# Altium schematic sheet Sheet1.SchDoc: Микромодуль беспроводной связи ВЧ
size 420 x 297 mm; ApprovedBy: Алексеев; CheckedBy: Богданов; Author: Пятиренко; DocumentNumber: АЕСН.464431.003Э3; SheetTotal: 1; PERVICH PRIM: АЕСН.464431.003; Title2: Схема электрическая принципиальная; DocumentName: Sheet1.SCHDOC; Application_BuildNumber: sdfsdfsdfsdfsdfs
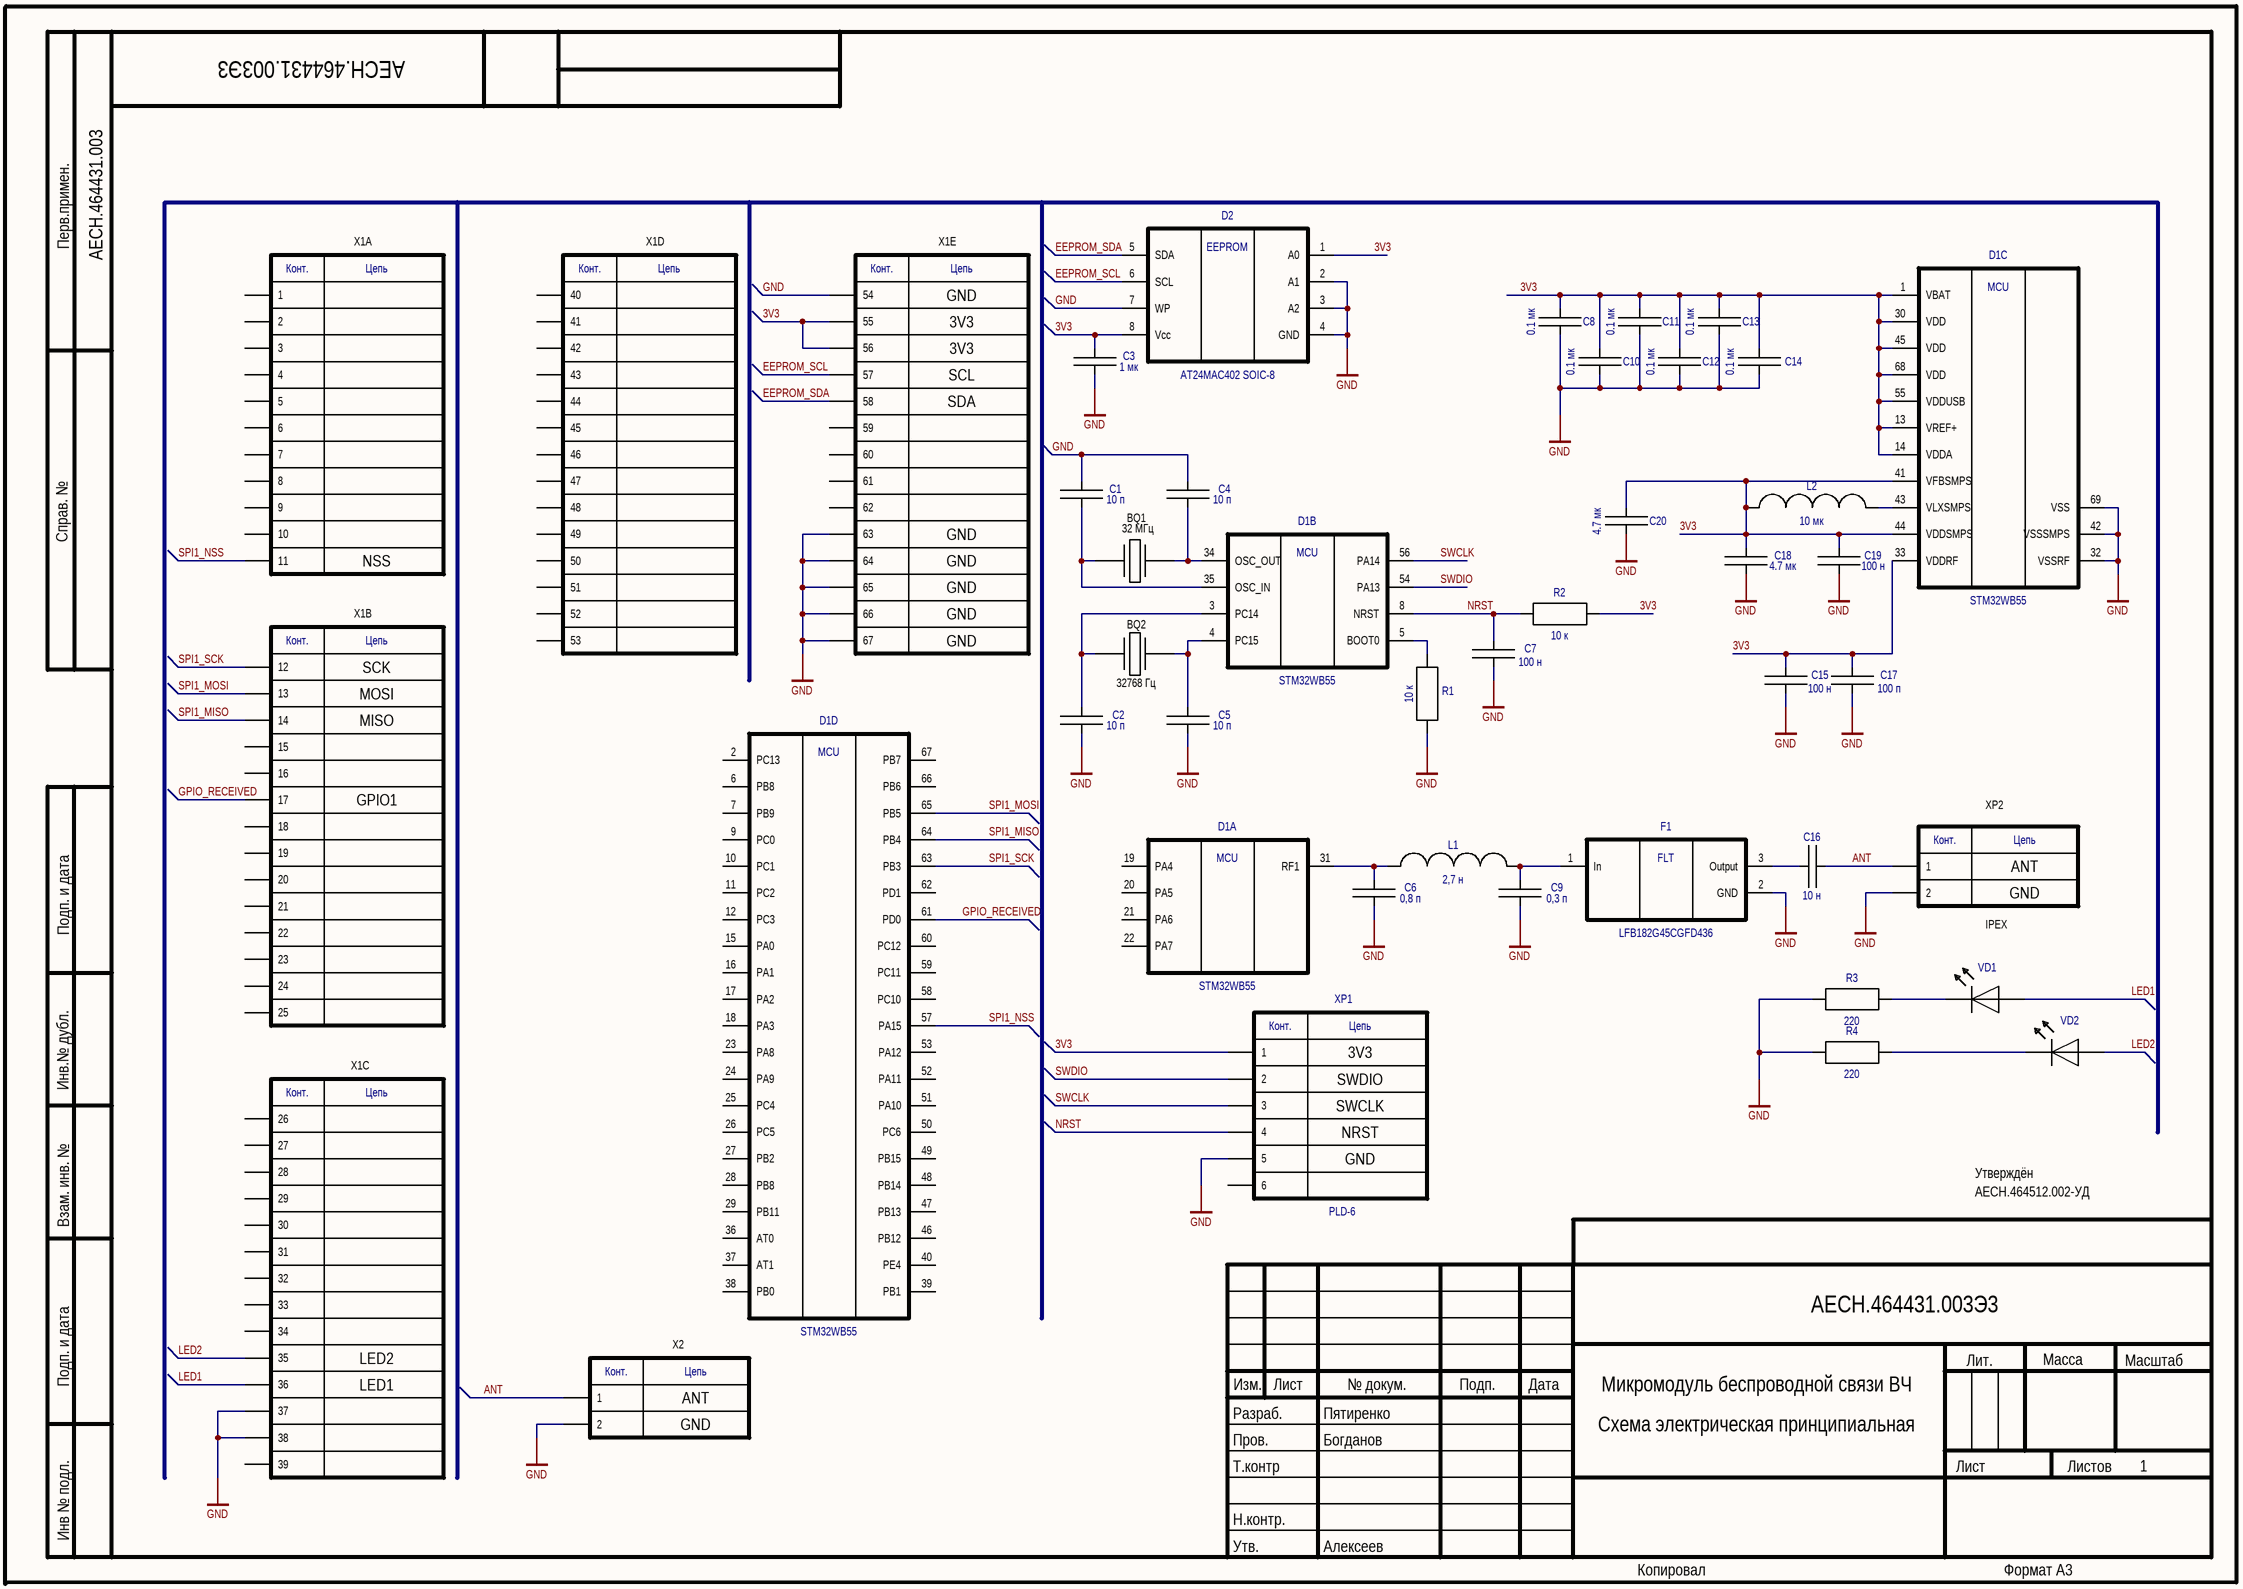
[diagram p0: Sheet1.SchDoc]

## Parts
BQ1  value 32 МГц  [Crystal_2520]  (hidden comment: Quarz)
BQ2  value 32768 Гц  [ABS07]  (hidden comment: Quarz)
C1  value 10 п  [C0603]  (hidden comment: C)
C2  value 10 п  [C0603]  (hidden comment: C)
C3  value 1 мк  [C0603]  (hidden comment: C)
C4  value 10 п  [C0603]  (hidden comment: C)
C5  value 10 п  [C0603]  (hidden comment: C)
C6  value 0,8 п  [C0603]  (hidden comment: C)
C7  value 100 н  [C0603]  (hidden comment: C)
C8  value 0.1 мк  [C0603]  (hidden comment: C)
C9  value 0,3 п  [C0603]  (hidden comment: C)
C10  value 0.1 мк  [C0603]  (hidden comment: C)
C11  value 0.1 мк  [C0603]  (hidden comment: C)
C12  value 0.1 мк  [C0603]  (hidden comment: C)
C13  value 0.1 мк  [C0603]  (hidden comment: C)
C14  value 0.1 мк  [C0603]  (hidden comment: C)
C15  value 100 н  [C0603]  (hidden comment: C)
C16  value 10 н  [C0603]  (hidden comment: C)
C17  value 100 п  [C0603]  (hidden comment: C)
C18  value 4.7 мк  [C0603]  (hidden comment: C)
C19  value 100 н  [C0603]  (hidden comment: C)
C20  value 4.7 мк  [C0603]  (hidden comment: C)
D1  STM32WB55  [VFQFN68-8x8mm]  (parts A,B,C,D of 4)
D2  AT24MAC402 SOIC-8  [SOIC8]
F1  LFB182G45CGFD436  [0603_3pin]
L1  value 2,7 н  [INDC_0603]  (hidden comment: L)
L2  value 10 мк  [R0805]  (hidden comment: L)
R1  value 10 к  [R0603]  (hidden comment: R)
R2  value 10 к  [R0603]  (hidden comment: R)
R3  value 220  [R0603]  (hidden comment: R)
R4  value 220  [R0603]  (hidden comment: R)
VD1  LED  [LED_0805]  (value not drawn)
VD2  LED  [LED_0805]  (value not drawn)
X1  M.2 - 1-2199230-4  [M.2 - 1-2199230-4 EDGE]  (value not drawn)  (parts A,B,C,D,E of 5)
X2  (no value)  [SMA_kont]
XP1  PLD-6  [PLD-6]
XP2  IPEX  [IPEX]

## Nets
GND: C1.1 C2.2 C3.2 C4.1 C5.2 C6.2 C7.2 C8.2 C9.2 C10.2 C11.2 C12.2 C13.2 C14.2 C15.2 C17.2 C18.2 C19.2 C20.2 D1.32(VSSRF) D1.42(VSSSMPS) D1.69(VSS) D2.2(A1) D2.3(A2) D2.4(GND) D2.7(WP) F1.2(GND) R1.1 R3.2 R4.2 X1.37 X1.38 X1.54 X1.63 X1.64 X1.65 X1.66 X1.67 X2.2 XP1.5 XP2.2
3V3: C3.1 C8.1 C10.1 C11.1 C12.1 C13.1 C14.1 C15.1 C17.1 C18.1 C19.1 C20.1 D1.1(VBAT) D1.13(VREF+) D1.14(VDDA) D1.30(VDD) D1.33(VDDRF) D1.41(VFBSMPS) D1.44(VDDSMPS) D1.45(VDD) D1.55(VDDUSB) D1.68(VDD) D2.1(A0) D2.8(Vcc) L2.1 R2.1 X1.55 X1.56 XP1.1
ANT: C16.2 X2.1 XP2.1
EEPROM_SCL: D2.6(SCL) X1.57
EEPROM_SDA: D2.5(SDA) X1.58
GPIO_RECEIVED: D1.61(PD0) X1.17
LED1: VD1.1 X1.36
LED2: VD2.1 X1.35
NRST: C7.1 D1.8(NRST) R2.2 XP1.4
SPI1_MISO: D1.64(PB4) X1.14
SPI1_MOSI: D1.65(PB5) X1.13
SPI1_NSS: D1.57(PA15) X1.11
SPI1_SCK: D1.63(PB3) X1.12
SWCLK: D1.56(PA14) XP1.3
SWDIO: D1.54(PA13) XP1.2
NetBQ1_1: BQ1.1 C1.2 D1.35(OSC_IN)
NetBQ1_2: BQ1.2 C4.2 D1.34(OSC_OUT)
NetBQ2_1: BQ2.1 C2.1 D1.3(PC14)
NetBQ2_2: BQ2.2 C5.1 D1.4(PC15)
NetC6_1: C6.1 D1.31(RF1) L1.1
NetC9_1: C9.1 F1.1(In) L1.2
NetC16_1: C16.1 F1.3(Output)
NetD1_5: D1.5(BOOT0) R1.2
NetD1_43: D1.43(VLXSMPS) L2.2
NetR3_1: R3.1 VD1.2
NetR4_1: R4.1 VD2.2

Not connected (* = marked no-connect by the designer): D1 2(PC13) 6(PB8) 7(PB9) 9(PC0) 10(PC1) 11(PC2) 12(PC3) 15(PA0) 16(PA1) 17(PA2) 18(PA3) 19(PA4) 20(PA5) 21(PA6) 22(PA7) 23(PA8) 24(PA9) 25(PC4) 26(PC5) 27(PB2) 28(PB8) 29(PB11) 36(AT0) 37(AT1) 38(PB0) 39(PB1) 40(PE4) 46(PB12) 47(PB13) 48(PB14) 49(PB15) 50(PC6) 51(PA10) 52(PA11) 53(PA12) 58(PC10) 59(PC11) 60(PC12) 62(PD1) 66(PB6) 67(PB7); X1 1 2 3 4 5 6 7 8 9 10 15 16 18 19 20 21 22 23 24 25 26 27 28 29 30 31 32 33 34 39 40 41 42 43 44 45 46 47 48 49 50 51 52 53 59 60 61 62; XP1 6

## Notes on the sheet
- 3V3
- GND
- SDA
- SCL
- NSS
- SCK
- MISO
- MOSI
- GPIO1
- ANT
- SWDIO
- SWCLK
- NRST
- АЕСН.464512.002-УД
- Утверждён
- LED1
- LED2
- Перв.примен.
- Справ. №
- Подп. и дата
- Инв.№ дубл.
- Взам. инв. №
- Изм.
- Лист
- № докум.
- Подп.
- Дата
- Лит.
- Масса
- Масштаб
- Пров.
- Т.контр
- Разраб.
- Листов
- Инв № подл.
- Н.контр.
- Утв.
- Копировал
- Формат А3
- (in symbol 2pin) Конт.; Цепь
- (in symbol 6pin) Конт.; Цепь
- (in symbol AT24MAC402) EEPROM
- (in symbol LFB182G45CGFD436) FLT
- (in symbol M.2, part A) Конт.; Цепь
- (in symbol M.2, part B) Конт.; Цепь
- (in symbol M.2, part C) Конт.; Цепь
- (in symbol M.2, part D) Конт.; Цепь
- (in symbol M.2, part E) Конт.; Цепь
- (in symbol STM32WB55, part A) MCU
- (in symbol STM32WB55, part B) MCU
- (in symbol STM32WB55, part C) MCU
- (in symbol STM32WB55, part D) MCU

## Library data of the parts
D2 = AT24MAC402
VD1 VD2 = VD_LED: Voltage: ?
X1 = M.2
X2 XP2 = 2pin
XP1 = 6pin: Manufacturer: *; PartNumber: PLD-6
C1-C20 = C: Voltage: ?